# Altium schematic sheet Tiva Pins.SchDoc
size A
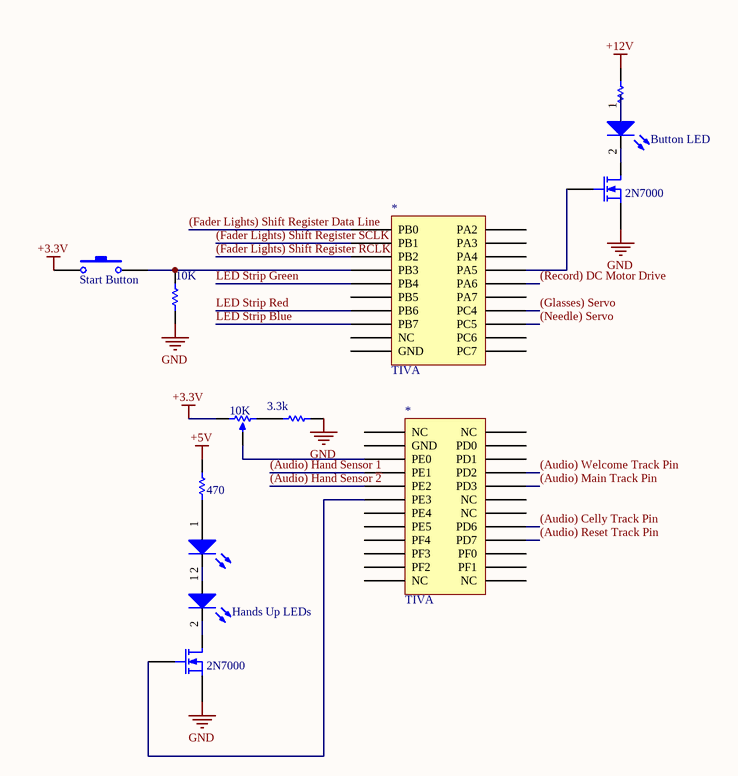
[diagram p0: Tiva Pins.SchDoc]

## Parts
(Parts that share a designator on the sheet are numbered #1, #2 ... from top to bottom, then left to right.)
*#1  TIVA
*#2  TIVA
DS?#1  Button LED  [DSO-F2/D6.1]
DS?#2  LED3  [DSO-F2/D6.1]  (value not drawn)
DS?#3  Hands Up LEDs  [DSO-F2/D6.1]
Q?#1  2N7000  [BCY-W3/D5]
Q?#2  2N7000  [BCY-W3/D5]
R?#1  Res1  [AXIAL-0.3]  (value not drawn)
R?#2  value 10K  [AXIAL-0.3]  (hidden comment: Res1)
R?#3  value 10K  [VR5]  (hidden comment: RPot1)
R?#4  3.3k  [AXIAL-0.3]
R?#5  470  [AXIAL-0.3]
S?  Start Button  [SPST-2]

## Nets
+3.3V: R?#3.1(TOP) S?.1
+5V: R?#5.2
+12V: R?#1.2
GND: Q?#1.1(S) Q?#2.1(S) R?#2.1 R?#4.1
(Audio) Celly Track Pin: *#2.17(PD6)
(Audio) Hand Sensor 1: *#2.4(PE1)
(Audio) Hand Sensor ~{2}: *#2.5(PE2)
(Audio) Main Track Pin: *#2.20(PD3)
(Audio) Reset Track Pin: *#2.16(PD7)
(Audio) Welcome Track Pin: *#2.21(PD2)
(Fader Lights) Shift Register Data Line: *#1.1(PB0)
(Fader Lights) Shift Register RCLK: *#1.3(PB2)
(Fader Lights) Shift Register SCLK: *#1.2(PB1)
(Glasses) Servo: *#1.14(PC4)
(Needle) Servo: *#1.13(PC5)
(Record) DC Motor Drive: *#1.16(PA6)
LED Strip Blue: *#1.8(PB7)
LED Strip Green: *#1.5(PB4)
LED Strip Red: *#1.7(PB6)
Net*#1_4: *#1.4(PB3) R?#2.2 S?.2
Net*#1_17: *#1.17(PA5) Q?#1.2(G)
Net*#2_3: *#2.3(PE0) R?#3.3(TAP)
Net*#2_6: *#2.6(PE3) Q?#2.2(G)
NetDS?#1_1: DS?#1.1(A) R?#1.1
NetDS?#1_2: DS?#1.2(K) Q?#1.3(D)
NetDS?#2_1: DS?#2.1(A) R?#5.1
NetDS?#2_2: DS?#2.2(K) DS?#3.1(A)
NetDS?#3_2: DS?#3.2(K) Q?#2.3(D)
NetR?#3_2: R?#3.2(BOT) R?#4.2

Not connected (* = marked no-connect by the designer): *#1 6(PB5) 9(NC) 10(GND) 11(PC7) 12(PC6) 15(PA7) 18(PA4) 19(PA3) 20(PA2); *#2 1(NC) 2(GND) 7(PE4) 8(PE5) 9(PF4) 10(PF3) 11(PF2) 12(NC) 13(NC) 14(PF1) 15(PF0) 18(NC) 19(NC) 22(PD1) 23(PD0) 24(NC)

## Library data of the parts
*#1 = Tiva_20: Tiva Protection 20 Pin Connector
*#2 = Tiva_24: Tiva Protection 24 Pin Connector
DS?#1-DS?#3 = LED3: Typical BLUE SiC LED; Manufacturer: Generic Components; Class: Optoelectronic; Published: 08/06/2000; Publisher: Altium Hobart Technology Centre; SubClass: LED
Q?#1 Q?#2 = 2N7000: N-Channel Enhancement Mode Vertical DMOS FET; Manufacturer: Zetex; Class: Discrete; SubClass: MOSFET - Low Power; Published: 8/06/2000; Publisher: Altium Hobart Technology Centre
R?#1 R?#2 R?#4 R?#5 = Res1: Resistor; Manufacturer: Generic Components; Class: Passive; Published: 08/06/2000; Publisher: Altium Hobart Technology Centre; SubClass: Resistor
R?#3 = RPot1: Potentiometer; Manufacturer: Generic Components; Class: Passive; Set Position: 0.5; Published: 08/06/2000; Publisher: Altium Hobart Technology Centre; SubClass: Potentiometer
S? = SW-PB: Switch; Manufacturer: Generic Components; Published: 1999